# EAGLE design stlink_v3_spi_flasher_shield (EAGLE 9.5.2)
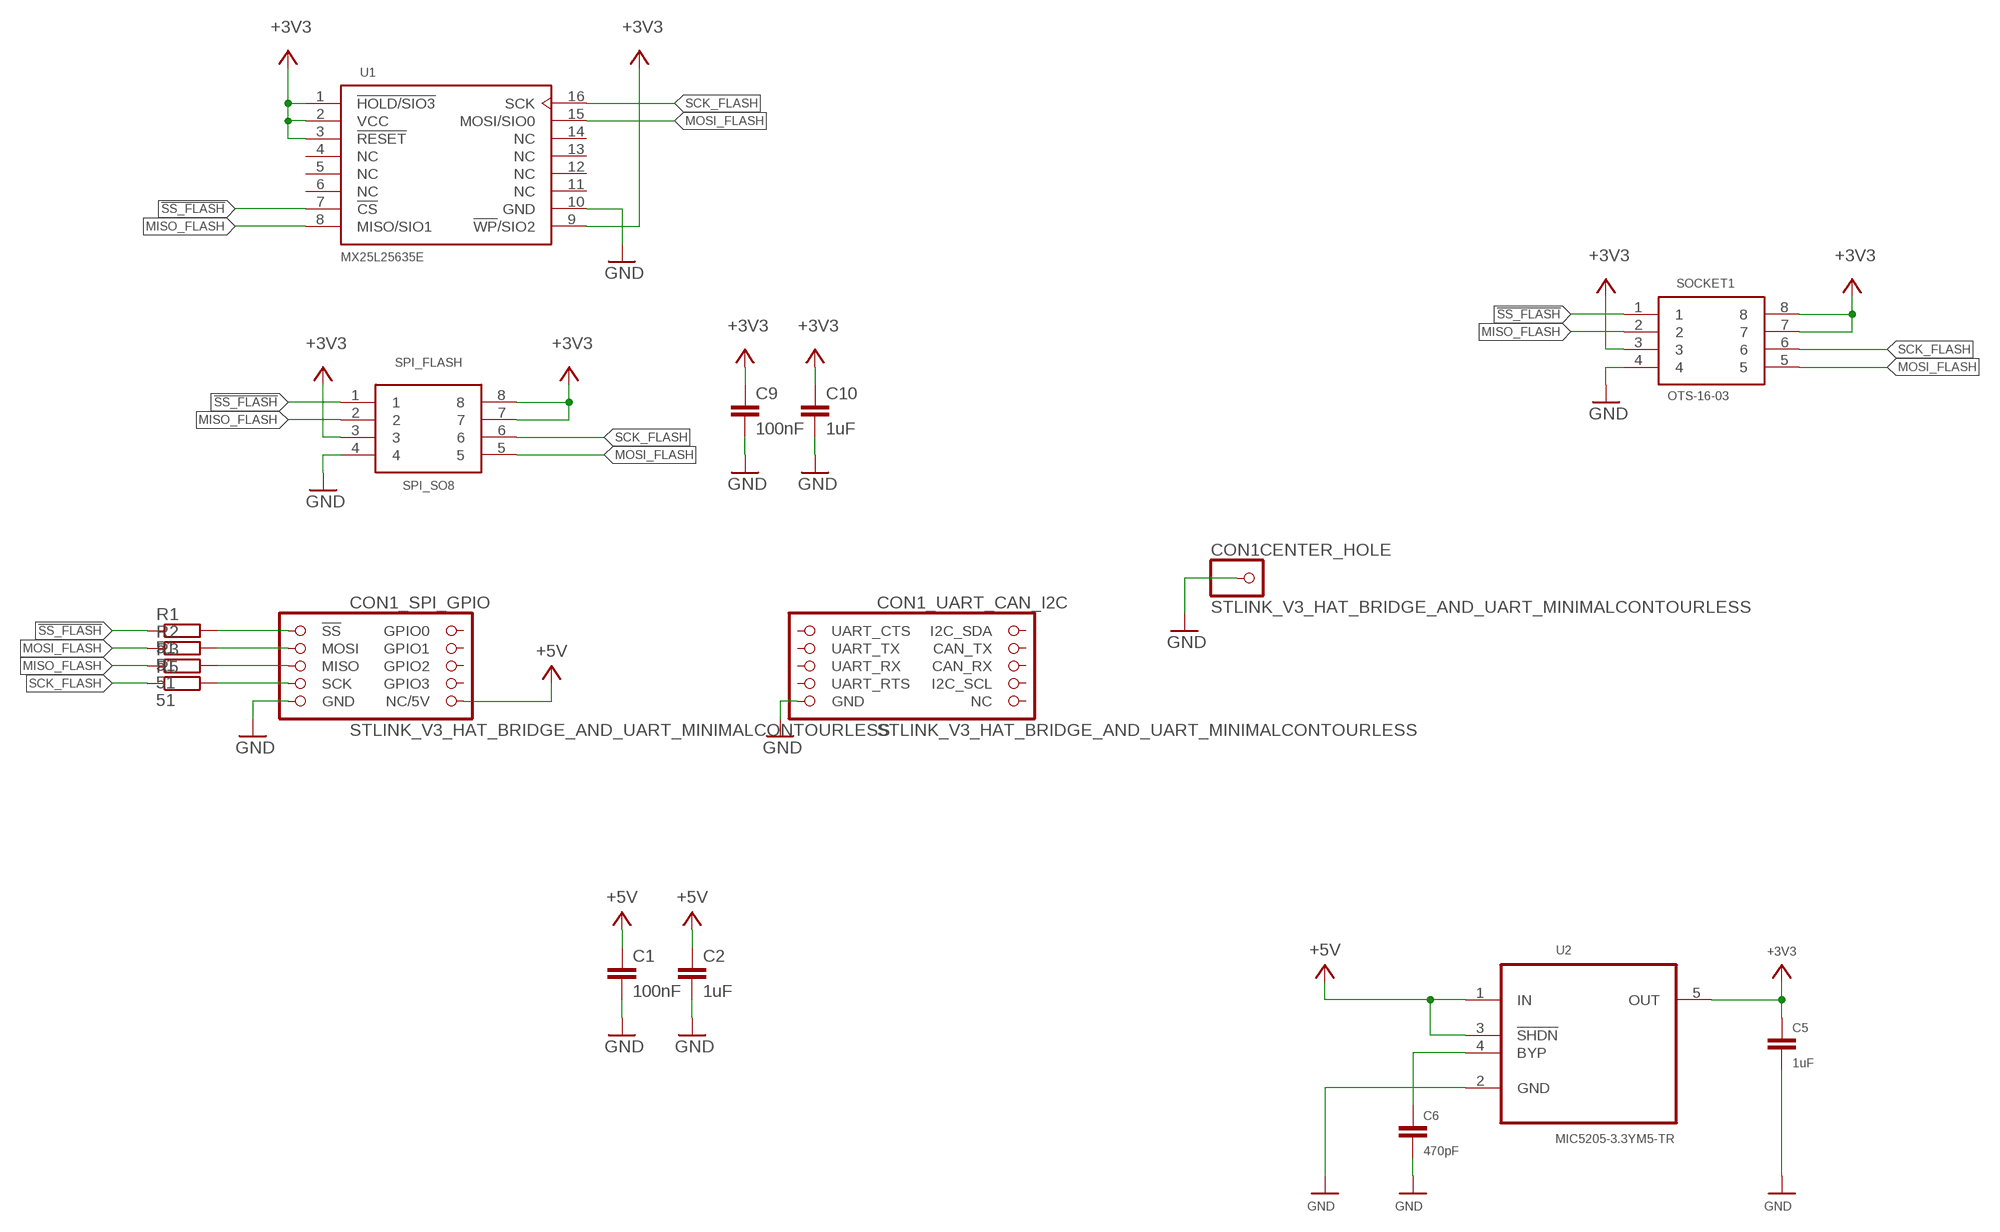
[diagram p0: schematic, sheet 1]

## Parts
C1  100nF  C-EUC0603  [C0603]
C2  1uF  C-EUC0603  [C0603]
C5  1uF  C-EUC0603  [C0603]
C6  470pF  C-EUC0603  [C0603]
C9  100nF  C-EUC0603  [C0603]
C10  1uF  C-EUC0603  [C0603]
CON1  STLINK_V3_HAT_BRIDGE_AND_UART_MINIMALCONTOURLESS  [STLINKV3_HAT_BRIDGE_MINIMAL_CONTOURLESS]
R1  51  R-EU_R0603  [R0603]
R2  51  R-EU_R0603  [R0603]
R3  51  R-EU_R0603  [R0603]
R5  51  R-EU_R0603  [R0603]
SOCKET1  OTS-16-03  [OTS-16-03]
SPI_FLASH  SPI_SO8  SO8_LONG  [SO8_LONG]
U1  MX25L25635E  [SOP127P780X200-16N]
U2  MIC5205-3.3YM5-TR  LT1761ES5-3.3TRMPBF  [SOT95P280X145-5N]

## Nets
!SS_FLASH: R1.1 SOCKET1.1 SPI_FLASH.1 U1.7(!CS)
!SS_STLINK: CON1.SPI_1(_SPI_GPIO:!SS) R1.2
+3V3: C5.1 C9.1 C10.1 SOCKET1.3 SOCKET1.7 SOCKET1.8 SPI_FLASH.3 SPI_FLASH.7 SPI_FLASH.8 U1.1(!HOLD/SIO3) U1.2(VCC) U1.3(!RESET) U1.9(!WP!/SIO2) U2.5(OUT)
+5V: C1.1 C2.1 CON1.SPI_10(_SPI_GPIO:NC/5V) U2.1(IN) U2.3(!SHDN)
GND: C1.2 C2.2 C5.2 C6.2 C9.2 C10.2 CON1.CENTER CON1.SPI_9(_SPI_GPIO:GND) CON1.UART_9(_UART_CAN_I2C:GND) SOCKET1.4 SPI_FLASH.4 U1.10(GND) U2.2(GND)
MISO_FLASH: R3.1 SOCKET1.2 SPI_FLASH.2 U1.8(MISO/SIO1)
MISO_STLINK: CON1.SPI_5(_SPI_GPIO:MISO) R3.2
MOSI_FLASH: R2.1 SOCKET1.5 SPI_FLASH.5 U1.15(MOSI/SIO0)
MOSI_STLINK: CON1.SPI_3(_SPI_GPIO:MOSI) R2.2
N$5: C6.1 U2.4(BYP)
SCK_FLASH: R5.1 SOCKET1.6 SPI_FLASH.6 U1.16(SCK)
SCK_STLINK: CON1.SPI_7(_SPI_GPIO:SCK) R5.2
Unconnected: CON1.SPI_2(_SPI_GPIO:GPIO0) CON1.SPI_4(_SPI_GPIO:GPIO1) CON1.SPI_6(_SPI_GPIO:GPIO2) CON1.SPI_8(_SPI_GPIO:GPIO3) CON1.UART_1(_UART_CAN_I2C:UART_CTS) CON1.UART_2(_UART_CAN_I2C:I2C_SDA) CON1.UART_3(_UART_CAN_I2C:UART_TX) CON1.UART_4(_UART_CAN_I2C:CAN_TX) CON1.UART_5(_UART_CAN_I2C:UART_RX) CON1.UART_6(_UART_CAN_I2C:CAN_RX) CON1.UART_7(_UART_CAN_I2C:UART_RTS) CON1.UART_8(_UART_CAN_I2C:I2C_SCL) CON1.UART_10(_UART_CAN_I2C:NC) U1.4(NC) U1.5(NC) U1.6(NC) U1.11(NC) U1.12(NC) U1.13(NC) U1.14(NC)

## Library data of the parts
C1 C2 C5 C6 C9 C10 = rcl:C-EU: CAPACITOR, European symbol
CON1 = stlinkv3:STLINK_V3_HAT_BRIDGE_AND_UART_MINIMAL
R1-R3 R5 = rcl:R-EU_: RESISTOR, European symbol
SOCKET1 = OTS_IC_sockets:OTS-16-03
SPI_FLASH = martonmiklos:SO8_LONG
U1 = SparkFun:MX25L25635E
U2 = LTC_By_element14_Batch_1:LT1761ES5-3.3TRMPBF: 100mA, Low Noise, LDO Micropower Regulators; MPN: LT1761ES5-3.3#TRMPBF; OC_FARNELL: 1663779; OC_NEWARK: 19P0920; OC_TME: MIC5205-3.3YM5-TR; PACKAGE: SOT-23-5; SUPPLIER: Linear Technology

## Board
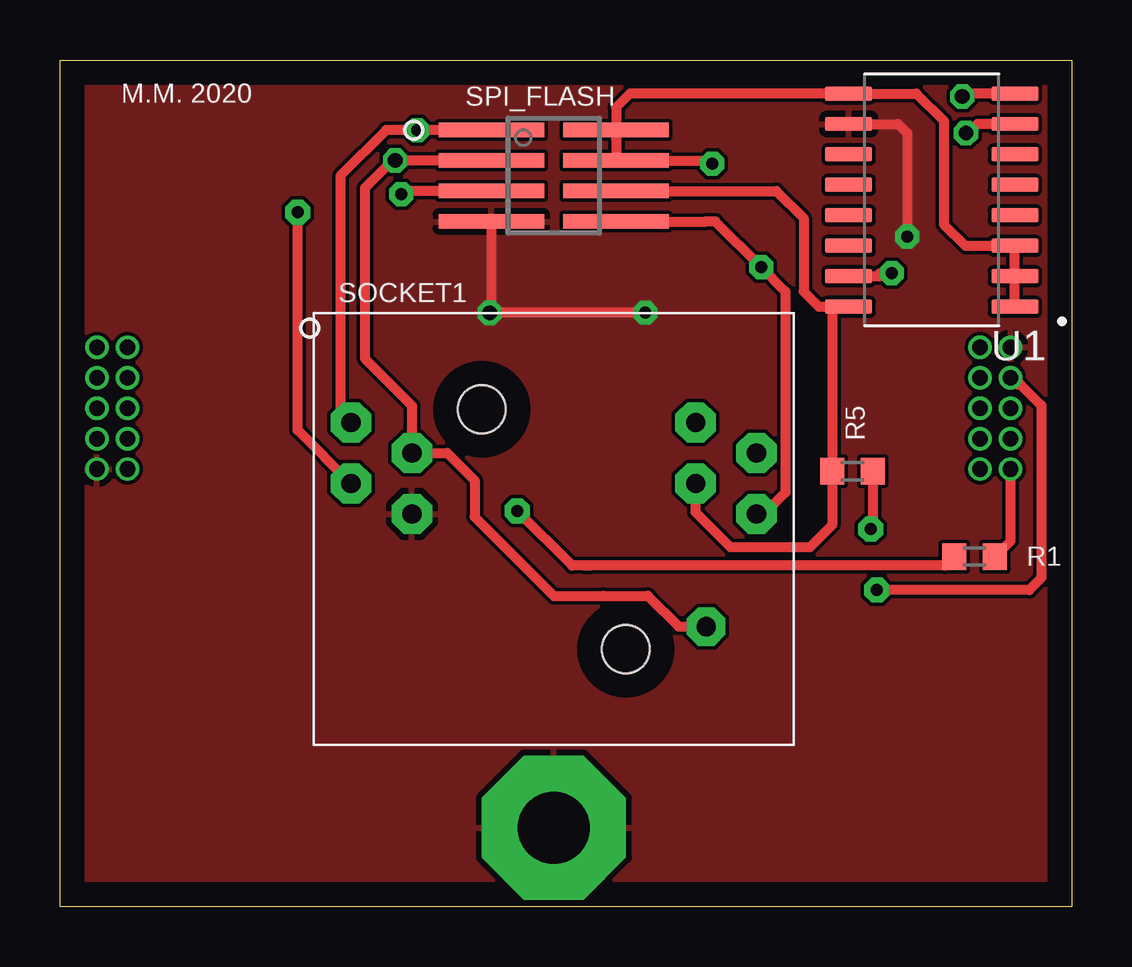
[diagram p1: board, top side]
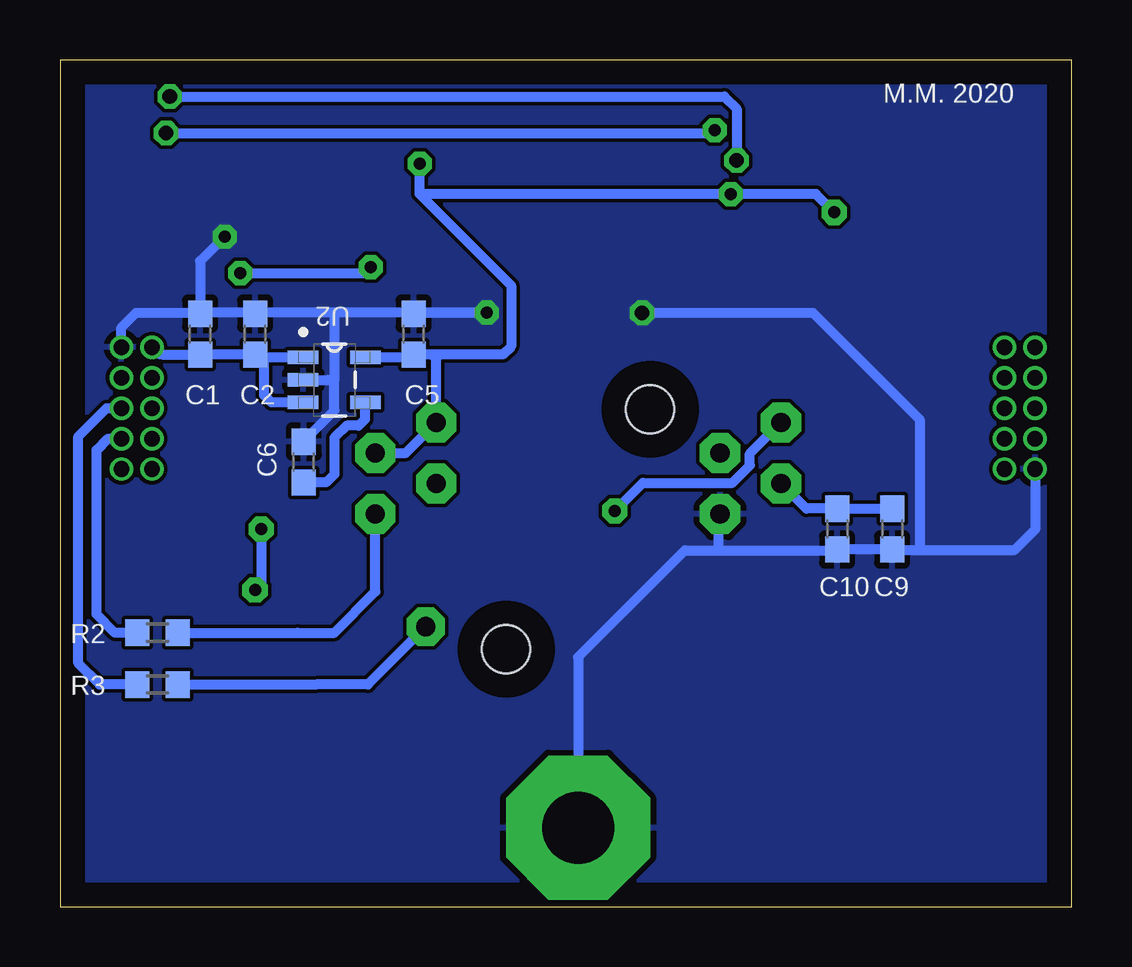
[diagram p2: board, bottom side, seen from below]

Size 42.16 x 35.31 mm. Coordinates in mm from the lower left corner, seen from the top.
Outline: 0,35.31 42.16,35.31 42.16,0.51 42.16,0 0,0 0,35.31
Copper layers (1*16): Top 0.035mm / dielectric 1.5mm / Bottom 0.035mm
Design rules "default *": minimum track width 10mil, minimum drill 0.5mm, track to track 6mil, track to pad 6mil, pad to pad 6mil, via to via 6mil, smd to smd 8mil, copper to edge 40mil, drill to drill 8mil, minimum pad ring 0.1mm, minimum via ring 8mil, stop-mask expansion 4mil, vias tented up to drill 0mil, thermal gap 10mil

### Footprints (pad centres in the part's own frame; a part is rotated, then mirrored left to right if it is on the bottom)
C0603 = smd 1.1 x 1: 1 -0.85,0; 2 0.85,0
STLINKV3_HAT_BRIDGE_MINIMAL_CONTOURLESS = drill 3 pad 6 octagon: CENTER 0,0 | drill 0.65: SPI_1 14.95,-19.035; SPI_2 14.95,-17.765; SPI_3 16.22,-19.035; SPI_4 16.22,-17.765; SPI_5 17.49,-19.035; SPI_6 17.49,-17.765; SPI_7 18.76,-19.035; SPI_8 18.76,-17.765; SPI_9 20.03,-19.035; SPI_10 20.03,-17.765; UART_1 20.03,19.035; UART_2 20.03,17.765; UART_3 18.76,19.035; UART_4 18.76,17.765; UART_5 17.49,19.035; UART_6 17.49,17.765; UART_7 16.22,19.035; UART_8 16.22,17.765; UART_9 14.95,19.035; UART_10 14.95,17.765
R0603 = smd 1 x 1.1: 1 -0.85,0; 2 0.85,0
OTS-16-03 = drill 0.8 pad 1.676 octagon: 1 -8.45,4.445; 2 -5.91,3.175; 3 -8.45,1.905; 4 -5.91,0.635; 5 8.45,0.635; 6 5.91,1.905; 7 8.45,3.175; 8 5.91,4.445 | hole 2: 3,-5; -3,5
SO8_LONG = smd 4.4 x 0.6: 1 -2.6,1.905; 2 -2.6,0.635; 3 -2.6,-0.635; 4 -2.6,-1.905; 5 2.6,-1.905; 6 2.6,-0.635; 7 2.6,0.635; 8 2.6,1.905
SOP127P780X200-16N = smd 1.97 x 0.61: 1 -3.465,4.445; 2 -3.465,3.175; 3 -3.465,1.905; 4 -3.465,0.635; 5 -3.465,-0.635; 6 -3.465,-1.905; 7 -3.465,-3.175; 8 -3.465,-4.445; 9 3.465,-4.445; 10 3.465,-3.175; 11 3.465,-1.905; 12 3.465,-0.635; 13 3.465,0.635; 14 3.465,1.905; 15 3.465,3.175; 16 3.465,4.445
SOT95P280X145-5N = smd 1.27 x 0.559: 1 -1.295,0.94; 2 -1.295,0; 3 -1.295,-0.94; 4 1.295,-0.94; 5 1.295,0.94

### Placement (x,y rotation side)
C1  36.32,23.88 90 bottom
C2  34.04,23.88 90 bottom
C5  27.43,23.88 90 bottom
C6  32,18.54 90 bottom
C9  7.49,15.75 270 bottom
C10  9.78,15.75 270 bottom
CON1  20.57,3.3 90 top
R1  38.1,14.61 0 top
R2  38.1,11.43 180 bottom
R3  38.1,9.27 180 bottom
R5  33.02,18.16 0 top
SOCKET1  20.57,15.75 0 top
SPI_FLASH  20.57,30.48 0 top
U1  36.32,29.46 180 top
U2  30.73,21.97 0 bottom

### Tracks (layer width: path | path; a pad name or v marks a point on that pad's centre or on a via)
!SS_FLASH  (via drill 0.5 pad 1, 0.5 pad 1.05, 0.61 pad 1)
  Top 0.406: R1.1 36.87,14.22 22.1,14.22 | 21.84,14.22 22.1,14.22 | SPI_FLASH.1 v14.88,32.39 13.59,32.39 11.68,30.48 11.68,20.09 SOCKET1.1 | U1.7 38.23,32.64 37.85,32.26 v37.74,32.26 | 22.1,14.22 21.34,14.22 v19.05,16.51
  Bottom 0.406: v37.74,32.26 15.24,32.26 14.99,32.51 14.88,32.4 v14.88,32.39 | v19.05,16.51 17.88,17.68 14.15,17.68 13.42,18.41 13.42,18.9 SOCKET1.1
!SS_STLINK
  Top 0.406: R1.2 39.61,15.26 CON1.SPI_1
+3V3  (via drill 0.5 pad 1, 0.5 pad 1.05)
  Top 0.406: SPI_FLASH.8 23.17,32 | 23.17,32 SPI_FLASH.7 27.05,31.12 v27.18,30.99 | SPI_FLASH.3 14.35,29.84 v14.22,29.72 | 23.17,32 23.17,33.33 23.75,33.91 U1.9 35.69,33.91 36.83,32.77 36.83,28.45 37.72,27.56 U1.3 U1.2 U1.1 | SOCKET1.3 9.91,19.87 v9.91,28.96
  Bottom 0.406: U2.5 27.55,22.91 | 27.55,22.91 C5.1 26.67,23.03 | 26.67,23.03 26.58,23.03 23.71,23.03 23.37,23.37 23.37,25.91 27.18,29.72 | 9.84,16.54 C10.1 | C10.1 C9.1 | v14.22,29.72 14.99,29.72 | 14.99,29.72 27.18,29.72 | 27.18,29.72 v27.18,30.99 | 27.72,22.74 27.55,22.91 | C10.1 11.07,16.6 SOCKET1.3 | v9.91,28.96 10.67,29.72 14.99,29.72 | SOCKET1.7 27.75,18.92 SOCKET1.8 26.48,22.84 26.67,23.03
+5V
  Bottom 0.406: 33.91,22.91 U2.1 | 33.91,22.91 33.92,22.91 C2.1 C1.1 37.91,23.03 37.93,23.05 38.05,23.05 CON1.SPI_10 | U2.3 33.35,21.03 33.66,21.34 33.66,22.66 33.91,22.91
GND  (via drill 0.5 pad 1, 0.61 pad 1)
  Top 0.406: SPI_FLASH.4 17.97,24.77 v17.91,24.77 v24.38,24.77 | U1.10 34.93,32.64 35.31,32.26 v35.31,27.94
  Bottom 0.406: 30.73,24.77 v24.38,24.77 27.39,24.77 C5.2 | 30.73,24.77 34,24.77 | 34,24.77 C2.2 | CON1.UART_9 1.54,15.73 2.41,14.86 6.35,14.86 | U2.2 30.99,21.97 30.73,21.97 | 30.73,24.77 30.73,21.97 | C6.2 32,19.43 30.73,20.7 30.73,21.97 | CON1.CENTER 20.57,10.41 16.13,14.86 14.73,14.86 | 6.35,14.86 7.53,14.86 C9.2 C10.2 9.82,14.86 14.73,14.86 | v17.91,24.77 10.79,24.77 6.35,20.32 6.35,14.86 | SOCKET1.4 14.73,16.31 14.73,14.86 | 34,24.77 36.07,24.77 | 36.07,24.77 36.28,24.77 C1.2 36.32,26.92 v35.31,27.94 | CON1.SPI_9 39.61,24.15 38.99,24.77 36.07,24.77
  pour Bottom: 0,35.31 42.16,35.31 42.16,0 0,0
  pour Top: 42.16,0 0,0 0,35.31 42.16,35.31
MISO_FLASH  (via drill 0.61 pad 1, 0.8 pad 1.6)
  Top 0.406: SPI_FLASH.2 v13.97,31.12 13.84,31.12 12.7,29.97 12.7,22.86 14.66,20.9 SOCKET1.2 16.13,18.92 17.27,17.78 17.27,16.26 20.57,12.95 21.59,12.95 22.64,12.95 22.66,12.97 24.49,12.97 25.78,11.68 v26.92,11.68 | U1.8 37.72,33.91 v37.59,33.78
  Bottom 0.406: R3.1 31.5,9.27 29.34,9.27 v26.92,11.68 | v37.59,33.78 14.48,33.78 13.97,33.27 v13.97,31.12
MISO_STLINK
  Bottom 0.406: R3.2 40.51,9.27 41.4,10.16 41.4,19.61 40.22,20.79 CON1.SPI_5
MOSI_FLASH  (via drill 0.5 pad 1)
  Top 0.406: SPI_FLASH.5 26.92,28.58 27.3,28.58 v29.21,26.67 30.23,25.65 30.23,17.27 29.34,16.38 SOCKET1.5 | U1.15 34.15,26.29 34.15,26.42 v34.65,26.42
  Bottom 0.406: v34.65,26.42 29.46,26.42 v29.21,26.67 | SOCKET1.5 29.02,13.14 30.73,11.43 32.26,11.43 R2.1
MOSI_STLINK
  Bottom 0.406: R2.2 39.88,11.43 40.64,12.19 40.64,19.05 40.17,19.52 CON1.SPI_3
N$5
  Bottom 0.406: U2.4 29.46,21.01 29.46,20.32 29.72,20.07 30.23,20.07 30.73,19.56 30.73,18.03 31.08,17.69 C6.1
SCK_FLASH
  Top 0.406: 32.17,18.03 32.17,15.91 31.24,14.99 27.94,14.99 26.48,16.44 SOCKET1.6 | 32.17,18.03 R5.1 | SPI_FLASH.6 29.84,29.84 30.99,28.7 30.99,25.65 31.62,25.02 U1.16 32.77,24.93 32.17,24.93 32.17,18.03
SCK_STLINK  (via drill 0.5 pad 1.05)
  Top 0.406: CON1.SPI_7 39.89,21.78 40.02,21.78 40.89,20.9 40.89,13.72 40.39,13.21 v34.04,13.21 | R5.2 33.87,15.84 v33.78,15.75
  Bottom 0.406: v33.78,15.75 33.78,13.46 v34.04,13.21

### Text on the board
tNames: M.M. 2020
bNames: M.M. 2020